# EAGLE design fabenergy.bridge.v2 (EAGLE 5.11)
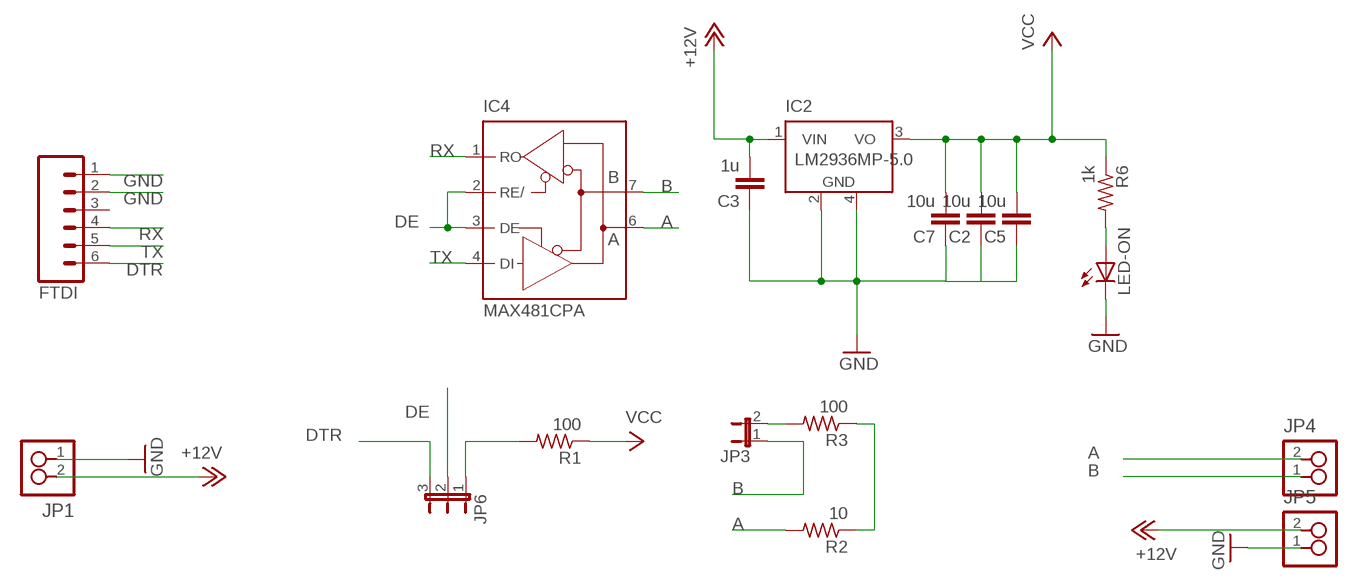
[diagram p0: schematic, sheet 1]

## Parts
C2  10u  C-EUC1206  [C1206]
C3  1u  C-EUC1206  [C1206]
C5  10u  C-EUC1206  [C1206]
C7  10u  C-EUC1206  [C1206]
FTDI  M06SMD  [1X06-SMD]
IC2  LM2936MP-5.0  [SOT223]
IC4  MAX481CPA  [DIL08]
JP1  2_PIN_HEADERSCREW  [SCREW_2]
JP3  JUMPER-2PTH  [1X02]
JP4  2_PIN_HEADERSCREW  [SCREW_2]
JP5  2_PIN_HEADERSCREW  [SCREW_2]
JP6  JP2E  [JP2]
LED-ON  LED1206  [1206]
R1  100  RESISTOR1206  [1206]
R2  10  RESISTOR1206  [1206]
R3  100  RESISTOR1206  [1206]
R6  1k  RESISTOR1206  [1206]

## Nets
+12V: C3.2 IC2.1(VIN) JP1.2 JP5.2
A: IC4.6(A) JP4.2 R2.2
B: IC4.7(B) JP3.1 JP4.1
DE: IC4.2(RE/) IC4.3(DE) JP6.2
DTR: FTDI.6 JP6.3
GND: C2.1 C3.1 C5.1 C7.1 FTDI.1 FTDI.2 IC2.2(GND) IC2.4(GND) JP1.1 JP5.1 LED-ON.2(C)
N$3: JP6.1 R1.2
N$6: LED-ON.1(A) R6.2
N$7: R2.1 R3.1
N$8: JP3.2 R3.2
RX: FTDI.4 IC4.1(RO)
TX: FTDI.5 IC4.4(DI)
VCC: C2.2 C5.2 C7.2 IC2.3(VO) R1.1 R6.1
Unconnected: FTDI.3

## Power pins joined to a net without a drawn wire
GND: IC4.5(GND)
VCC: IC4.8(VCC)

## Library data of the parts
C2 C3 C5 C7 = rcl:C-EU: CAPACITOR, European symbol
FTDI = SparkFun:M06: Header 6 Standard 6-pin 0.1" header. Use with straight break away headers (SKU : PRT-00116), right angle break away headers (PRT-00553), swiss pins (PRT-00743), machine pins (PRT-00117), and female headers (PRT-00115). Molex polarized connector foot print use with SKU : PRT-08094 with associated crimp pins and housings. NOTES ON THE VARIANTS LOCK and LOCK_LONGPADS... This footprint was designed to help hold the alignment of a through-hole component (i.e. 6-pin header) while soldering it into place. You may notice that each hole has been shifted either up or down by 0.005 of an inch from it's more standard position (which is a perfectly straight line). This slight alteration caused the pins (the squares in the middle) to touch the edges of the holes. Because they are alternating, it causes a "brace" to hold the component in place. 0.005 has proven to be the perfect amount of "off-center" position when using our standard breakaway headers. Although looks a little odd when you look at the bare footprint, once you have a header in there, the alteration is very hard to notice. Also, if you push a header all the way into place, it is covered up entirely on the bottom side. This idea of altering the position of holes to aid alignment will be further integrated into the Sparkfun Library for other footprints. It can help hold any component with 3 or more connection pins.
IC2 = national-semiconductor:LM2936MP?*: Ultra-Low Quiescent Current LDO Voltage Regulator Source: Data sheet <http://www.national.com/ds/LM/LM2936.pdf>; MF: NATIONAL SEMICONDUCTOR; MPN: LM2936MP-5.0/NOPB; OC_FARNELL: 1469063; OC_NEWARK: 41K4524
IC4 = maxim:MAX481CPA: RS485 TRANSEIVER
JP1 JP4 JP5 = ng:2_PIN_HEADER: 2 SMT pin pads
JP3 = SparkFun:JUMPER-2: Jumper Basic 0.1" spaced jumper. Use with breakaway headers.
JP6 = jumper:JP2E: JUMPER
LED-ON = ng:LED
R1-R3 R6 = ng:RESISTOR

## Net classes
0 default: width 0.203 mm

## Board
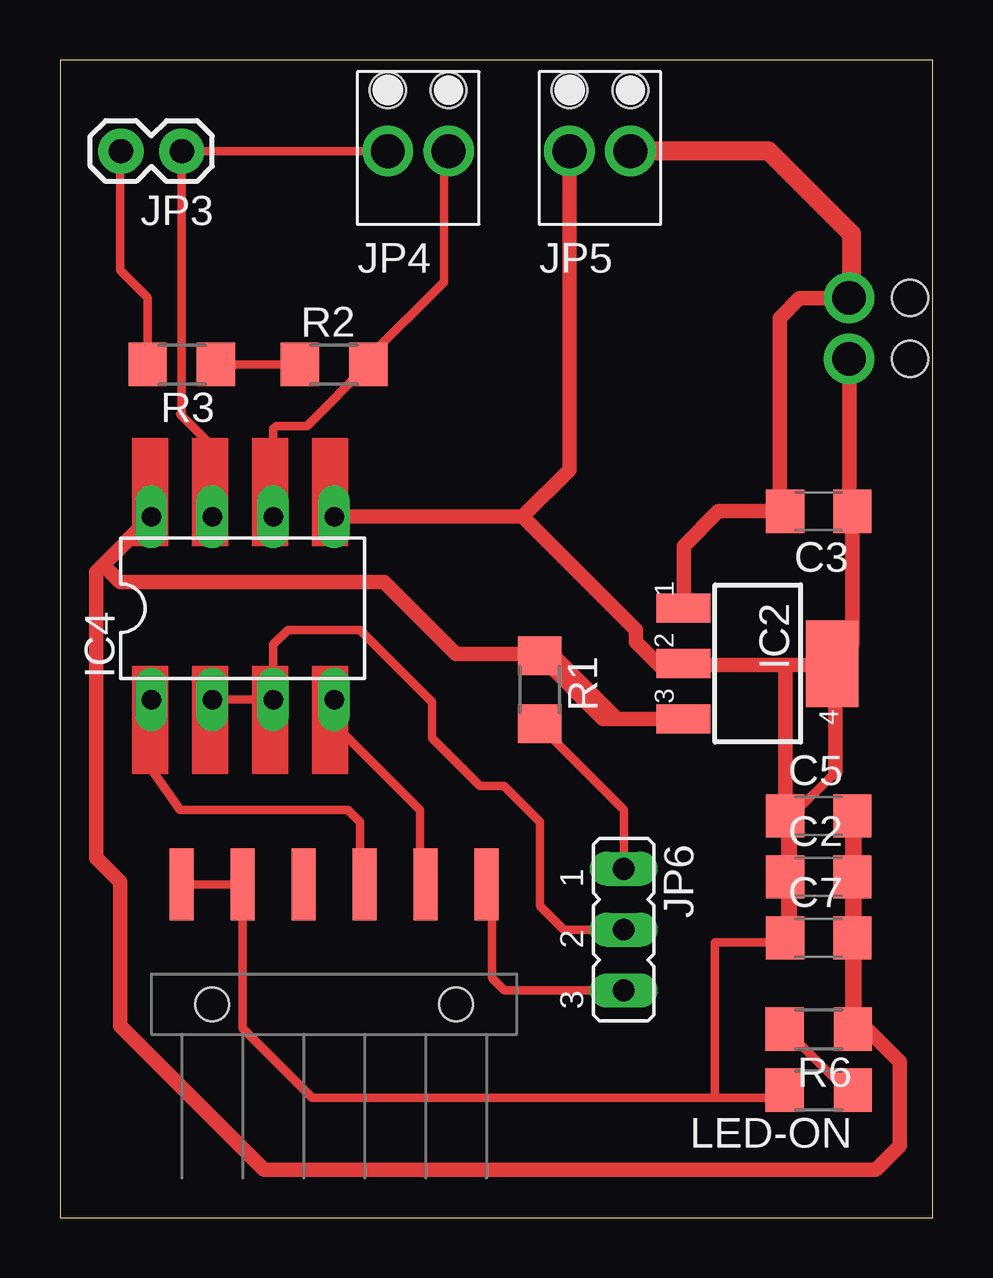
[diagram p1: board, top side]
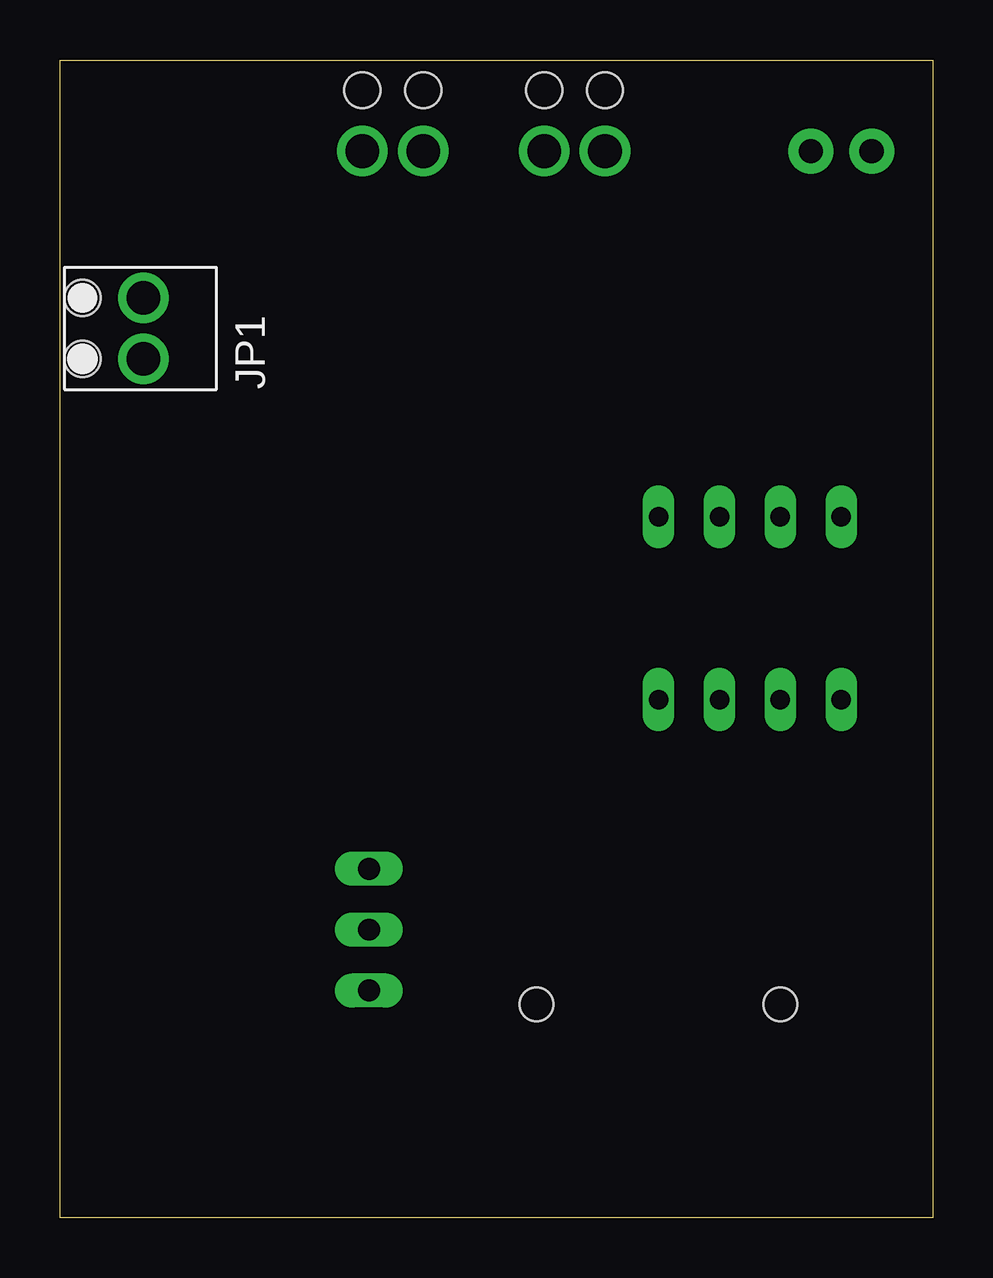
[diagram p2: board, bottom side, seen from below]

Size 36.38 x 48.25 mm. Coordinates in mm from the lower left corner, seen from the top.
Outline: 0,0 36.38,0 36.38,48.25 0,48.25 0,0
Copper layers (1*16): Top 0.035mm / dielectric 1.5mm / Bottom 0.035mm
Design rules "default *": minimum track width 0.35mm, minimum drill 24mil, track to track 0.4mm, track to pad 0.4mm, pad to pad 0.4mm, via to via 0.4mm, smd to smd 8mil, copper to edge 40mil, drill to drill 8mil, minimum pad ring 10mil, minimum via ring 8mil, stop-mask expansion 4mil, vias tented up to drill 0mil, thermal gap 10mil

### Footprints (pad centres in the part's own frame; a part is rotated, then mirrored left to right if it is on the bottom)
C1206 = smd 1.6 x 1.8: 1 -1.4,0; 2 1.4,0
1X06-SMD = smd 1 x 3: 1 -6.35,5; 2 -3.81,5; 3 -1.27,5; 4 1.27,5; 5 3.81,5; 6 6.35,5 | hole 1.4: -5.08,0; 5.08,0
SOT223 = smd 1.219 x 2.235: 1 -2.311,-3.099; 2 0,-3.099; 3 2.311,-3.099 | smd 3.6 x 2.2: 4 0,3.099
DIL08 = drill 0.813 long: 1 -3.81,-3.81; 2 -1.27,-3.81; 3 1.27,-3.81; 4 3.81,-3.81; 5 3.81,3.81; 6 1.27,3.81; 7 -1.27,3.81; 8 -3.81,3.81
SCREW_2 = drill 1.4 pad 2.108 round: 1 -1.27,-1.27; 2 1.27,-1.27 | hole 1.5: 1.27,1.27; -1.27,1.27
1X02 = drill 1.016 pad 1.88 round: 1 0,0; 2 2.54,0
JP2 = drill 0.914 long: 1 -2.54,0; 2 0,0; 3 2.54,0
1206 = smd 1.6 x 1.803: 1 -1.422,0; 2 1.422,0

### Placement (x,y rotation side)
C2  31.63,14.2 0 top
C3  31.63,29.44 180 top
C5  31.63,16.74 0 top
C7  31.63,11.66 0 top
FTDI  11.43,8.89 0 top
IC2  29.09,23.09 270 top
IC4  7.62,25.4 0 top
JP1  34.17,37.06 90 bottom
JP3  5.08,44.45 180 top
JP4  14.93,45.72 0 top
JP5  22.51,45.72 0 top
JP6  23.5,12 270 top
LED-ON  31.63,5.31 180 top
R1  20,22 270 top
R2  11.43,35.56 0 top
R3  5.08,35.56 180 top
R6  31.63,7.85 180 top

### Tracks (layer width: path | path; a pad name or v marks a point on that pad's centre or on a via)
+12V
  Top 0.35: C3.2 30,29.67 | IC2.1
  Top 0.6: JP1.2 30.83,38.33 30,37.5 30,29.67 | C3.2 27.44,29.44 26,28 IC2.1
  Top 0.8: JP5.2 29.55,44.45 33,41 33,38.43 JP1.2
A
  Top 0.35: IC4.6 8.89,32.89 9,33 10.29,33 R2.2 12.85,35.85 16,39 16,44.25 JP4.2
B
  Top 0.35: JP4.1 JP3.1 5.08,33.58 5,33.5 6.5,32 6.5,29.36 IC4.7
DE
  Top 0.35: IC4.2 IC4.3 8.89,23.89 9.5,24.5 12.5,24.5 15.5,21.5 15.5,20 17.5,18 18.5,18 20,16.5 20,13 21,12 JP6.2
DTR
  Top 0.35: JP6.3 18.54,9.46 18,10 18,13.67 FTDI.6
GND
  Top 0.35: FTDI.1 FTDI.2 7.62,7.88 10.5,5 27.3,5 | C3.1 32.9,29.57 | IC2.4 33.03,23.93 | 27.3,5 29.9,5 LED-ON.2 | 26.08,23.04 IC2.2 | 32.16,23.04 IC2.4 | 30.24,16.8 C5.1 30.24,16.64 30.24,14.24 C2.1 30.24,14.08 30.24,11.68 C7.1 30.03,11.46 27.3,11.46 27.3,5 | 32.32,18.56 30.56,16.8 30.56,11.72 | IC2.4 32.32,23.04
  Top 0.6: 32.9,29.57 JP1.1 | 33.03,23.93 C3.1 | 30.24,23.04 32.16,23.04 | 30.24,23.04 26.08,23.04 | 30.24,16.8 30.24,23.04 | 32.32,23.04 32.32,18.56 | 19.29,29.21 IC4.5 | 19.29,29.21 24,24.5 24,24 25,23 25.9,23 IC2.2 | JP5.1 21.24,31.16 19.29,29.21
N$3
  Top 0.35: R1.2 20,20.5 23.5,17 JP6.1
N$6
  Top 0.35: R6.2 30.24,7.84 32.64,5.44 32.96,5.44 LED-ON.1
N$7
  Top 0.35: R3.1 R2.1
N$8
  Top 0.35: R3.2 3.66,38.34 2.5,39.5 2.5,44.41 JP3.2
RX
  Top 0.35: IC4.1 3.81,18.69 5,17 12,17 12.5,16.5 12.5,14 13,13.5 13,13.59 FTDI.4
TX
  Top 0.35: IC4.4 11.43,20.57 15,17 15,14.13 FTDI.5
VCC
  Top 0.35: 33.12,11.68 C7.2 33.12,11.52 | 33.12,14.08 C2.2 33.12,14.24 | C5.2 33.12,16.64 | 33.12,8 R6.1
  Top 0.6: 33.12,14.08 33.12,11.68 | 33.12,16.64 33.12,14.24 | 33.12,11.52 33.12,8 | C5.2 33.03,8.47 35,6.5 35,3 34,2 8.5,2 2.5,8 2.5,14 1.5,15 1.5,26.9 1.8,27.2 | 1.8,27.2 IC4.8 | R1.1 22.64,20.78 IC2.3 23.22,20.78 20.5,23.5 16.5,23.5 13.5,26.5 2.5,26.5 1.8,27.2
(copper drawn outside any net)
  shapes: Top area x16